# Altium schematic sheet OPAMP.SchDoc
size A4; SheetNumber: 21; SheetTotal: 22
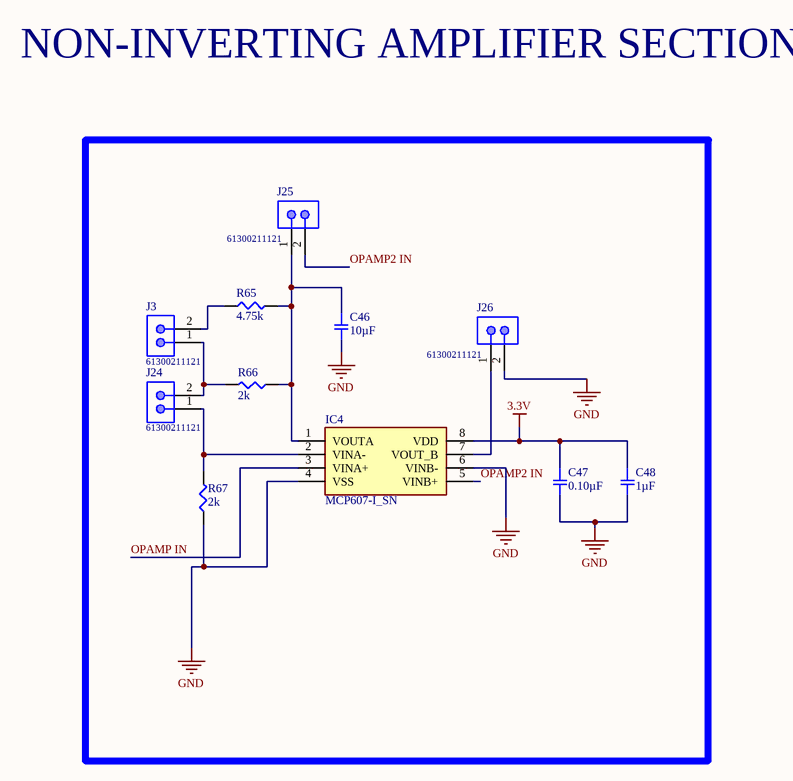
[diagram p0: OPAMP.SchDoc]

## Parts
C46  10µF  [SMD-0805C]
C47  0.10µF  [SMD-0805C]
C48  1µF  [SMD-0805C]
IC4  MCP607-I_SN  [SOIC127P600X175-8N]
J3  61300211121  [61300211121]
J24  61300211121  [61300211121]
J25  61300211121  [61300211121]
J26  61300211121  [61300211121]
R65  4.75k  [SMD-0805-RES]
R66  2k  [SMD-0805-RES]
R67  2k  [SMD-0805-RES]

## Nets
3.3V: C47.1 C48.1 IC4.8(VDD)
GND: C46.2 C47.2 C48.2 IC4.4(VSS) IC4.6(VINB-) J26.2 R67.1
OPAMP2 IN: IC4.5(VINB+) J25.2
OPAMP IN: IC4.3(VINA+)
NetC46_1: C46.1 IC4.1(VOUTA) J25.1 R65.2 R66.1
NetIC4_2: IC4.2(VINA-) J24.1 R67.2
NetIC4_7: IC4.7(VOUT_B) J26.1
NetJ3_1: J3.1 J24.2 R66.2
NetJ3_2: J3.2 R65.1

## Notes on the sheet
- NON-INVERTING AMPLIFIER SECTION

## Library data of the parts
C46 = GCJ21BR71A106KE01L: CAP CER 10UF 10V X7R 0805; Manufacturer: Murata Electronics North America; Factory Stock: 0; Unit Price (USD): 0.56; Minimum Quantity: 1; Tolerance: ±10%; Datasheets: http://www.murata.com/~/media/webrenewal/support/library/catalog/products/capacitor/mlcc/c03e.ashx; Image: //media.digikey.com/Renders/Murata%20Renders/0805%20(2012%20Metric)%20.85mm.jpg; Digi-Key Part Number: 490-12646-1-ND; Part Number: GCJ21BR71A106KE01L; Quantity Available: 2702; @ qty: 0; Packaging: Cut Tape (CT); Series: GCJ; Part Status: Active; Value: 10µF; Voltage: 10V; Temperature Coefficient: X7R; Operating Temperature: -55°C ~ 125°C; Features: Soft Termination; Ratings: AEC-Q200; Applications: Automotive, Boardflex Sensitive; Mounting Type: Surface Mount, MLCC; Package / Case: 0805 (2012 Metric); Size / Dimension: 0.079" L x 0.049" W (2.00mm x 1.25mm); Height - Seated (Max): -; Thickness (Max): 0.057" (1.45mm); Lead Spacing: -; Lead Style: -
C47 = GCD21BR71H104KA01L: CAP CER 0.1UF 50V X7R 0805; Manufacturer: Murata Electronics North America; Factory Stock: 0; Unit Price (USD): 0.24; Minimum Quantity: 1; Tolerance: ±10%; Datasheets: http://www.murata.com/~/media/webrenewal/support/library/catalog/products/capacitor/mlcc/c03e.ashx; Image: //media.digikey.com/Renders/Murata%20Renders/0805%28GxM6%29.jpg; Digi-Key Part Number: 490-11955-1-ND; Part Number: GCD21BR71H104KA01L; Quantity Available: 157; @ qty: 0; Packaging: Cut Tape (CT); Series: GCD; Part Status: Active; Value: 0.10µF; Voltage: 50V; Temperature Coefficient: X7R; Operating Temperature: -55°C ~ 125°C; Features: -; Ratings: AEC-Q200; Applications: Automotive; Mounting Type: Surface Mount, MLCC; Package / Case: 0805 (2012 Metric); Size / Dimension: 0.079" L x 0.049" W (2.00mm x 1.25mm); Height - Seated (Max): -; Thickness (Max): 0.049" (1.25mm); Lead Spacing: -; Lead Style: -
C48 = GCJ219R71C105KA01D: CAP CER 1UF 16V X7R 0805; Manufacturer: Murata Electronics North America; Factory Stock: 0; Unit Price (USD): 0.29; Minimum Quantity: 1; Tolerance: ±10%; Datasheets: http://www.murata.com/~/media/webrenewal/support/library/catalog/products/capacitor/mlcc/c03e.ashx; Image: //media.digikey.com/Renders/Murata%20Renders/0805%20(2012%20Metric)%20.85mm.jpg; Digi-Key Part Number: 490-5800-1-ND; Part Number: GCJ219R71C105KA01D; Quantity Available: 140338; @ qty: 0; Packaging: Cut Tape (CT); Series: GCJ; Part Status: Active; Value: 1µF; Voltage: 16V; Temperature Coefficient: X7R; Operating Temperature: -55°C ~ 125°C; Features: Soft Termination; Ratings: AEC-Q200; Applications: Automotive, Boardflex Sensitive; Mounting Type: Surface Mount, MLCC; Package / Case: 0805 (2012 Metric); Size / Dimension: 0.079" L x 0.049" W (2.00mm x 1.25mm); Height - Seated (Max): -; Thickness (Max): 0.037" (0.95mm); Lead Spacing: -; Lead Style: -
IC4 = MCP607-I_SN: Integrated Circuit; Manufacturer_Name: Microchip; Manufacturer_Part_Number: MCP607-I/SN; Datasheet Link: http://ww1.microchip.com/downloads/en/DeviceDoc/11177f.pdf; Height: 1.75mm; Mouser Part Number: 579-MCP607-I/SN; Mouser Price/Stock: https://www.mouser.co.uk/ProductDetail/Microchip-Technology/MCP607-I-SN/?qs=Ux5rHyN1IXQVM1mIseVI1A%3D%3D; Arrow Part Number: MCP607-I/SN; Arrow Price/Stock: https://www.arrow.com/en/products/mcp607-isn/microchip-technology?region=nac
J3 J24-J26 = 61300211121: WR-PHD Pin Header, THT, pitch 2.54mm, Single Row, Vertical, 2pin; Pin Number: 2; Gender: Male; Rated Current: 3A; Working Voltage: 250VAC; Withstanding Voltage: 500VAC; Contact Resistance: 20mOhm; ComponentLink1Description: Manufacturer; ComponentLink1URL: http://www.we-online.de; ComponentLink2Description: Datasheet; ComponentLink2URL: https://katalog.we-online.de/em/datasheet/6130xx11121.pdf; Part Number: 61300211121; Published Date: June 2019; Publisher: Wurth Elektronik; Pitch: 2.54mm; Operating Temperature: -40 to +105degC; Mounting Technology: THT; Packaging: Bag; Row Number: Single; Orientation: Vertical
R65 = ERJ-6ENF4751V: RES SMD 4.75K OHM 1% 1/8W 0805; Manufacturer: Panasonic Electronic Components; Factory Stock: 0; Unit Price (USD): 0.00729; @ qty: 1500; Minimum Quantity: 1; Power (Watts): 0.125W, 1/8W; Temperature Coefficient: ±100ppm/°C; Part Number: ERJ-6ENF4751V; Datasheets: http://industrial.panasonic.com/www-cgi/jvcr13pz.cgi?E+PZ+3+AOA0002+ERJ6ENF4751V+7+WW; Image: //media.digikey.com/Renders/Panasonic%20Renders/ERJ-0805%20Pkg.jpg; Digi-Key Part Number: P4.75KCCT-ND; Quantity Available: 354774; Packaging: Cut Tape (CT); Series: ERJ; Part Status: Active; Value: 4.75k; Tolerance: ±1%; Composition: Thick Film; Features: Automotive AEC-Q200; Operating Temperature: -55°C ~ 155°C; Package / Case: 0805 (2012 Metric); Supplier Device Package: 0805; Size / Dimension: 0.079" L x 0.049" W (2.00mm x 1.25mm); Height - Seated (Max): 0.028" (0.70mm); Number of Terminations: 2; Failure Rate: -
R66 R67 = ERJ-P06D2001V: RES SMD 2K OHM 0.5% 1/2W 0805; Manufacturer: Panasonic Electronic Components; Factory Stock: 0; Unit Price (USD): 0.04514; @ qty: 1500; Minimum Quantity: 1; Power (Watts): 0.5W, 1/2W; Temperature Coefficient: ±100ppm/°C; Part Number: ERJ-P06D2001V; Datasheets: https://industrial.panasonic.com/cdbs/www-data/pdf/RDA0000/AOA0000C243.pdf; Image: //media.digikey.com/Renders/Panasonic%20Renders/ERJ-0805%20Pkg.jpg; Digi-Key Part Number: P16044CT-ND; Quantity Available: 25431; Packaging: Cut Tape (CT); Series: ERJ; Part Status: Active; Value: 2k; Tolerance: ±0.5%; Composition: Thick Film; Features: Automotive AEC-Q200, Pulse Withstanding; Operating Temperature: -55°C ~ 155°C; Package / Case: 0805 (2012 Metric); Supplier Device Package: 0805; Size / Dimension: 0.079" L x 0.049" W (2.00mm x 1.25mm); Height - Seated (Max): 0.028" (0.70mm); Number of Terminations: 2; Failure Rate: -